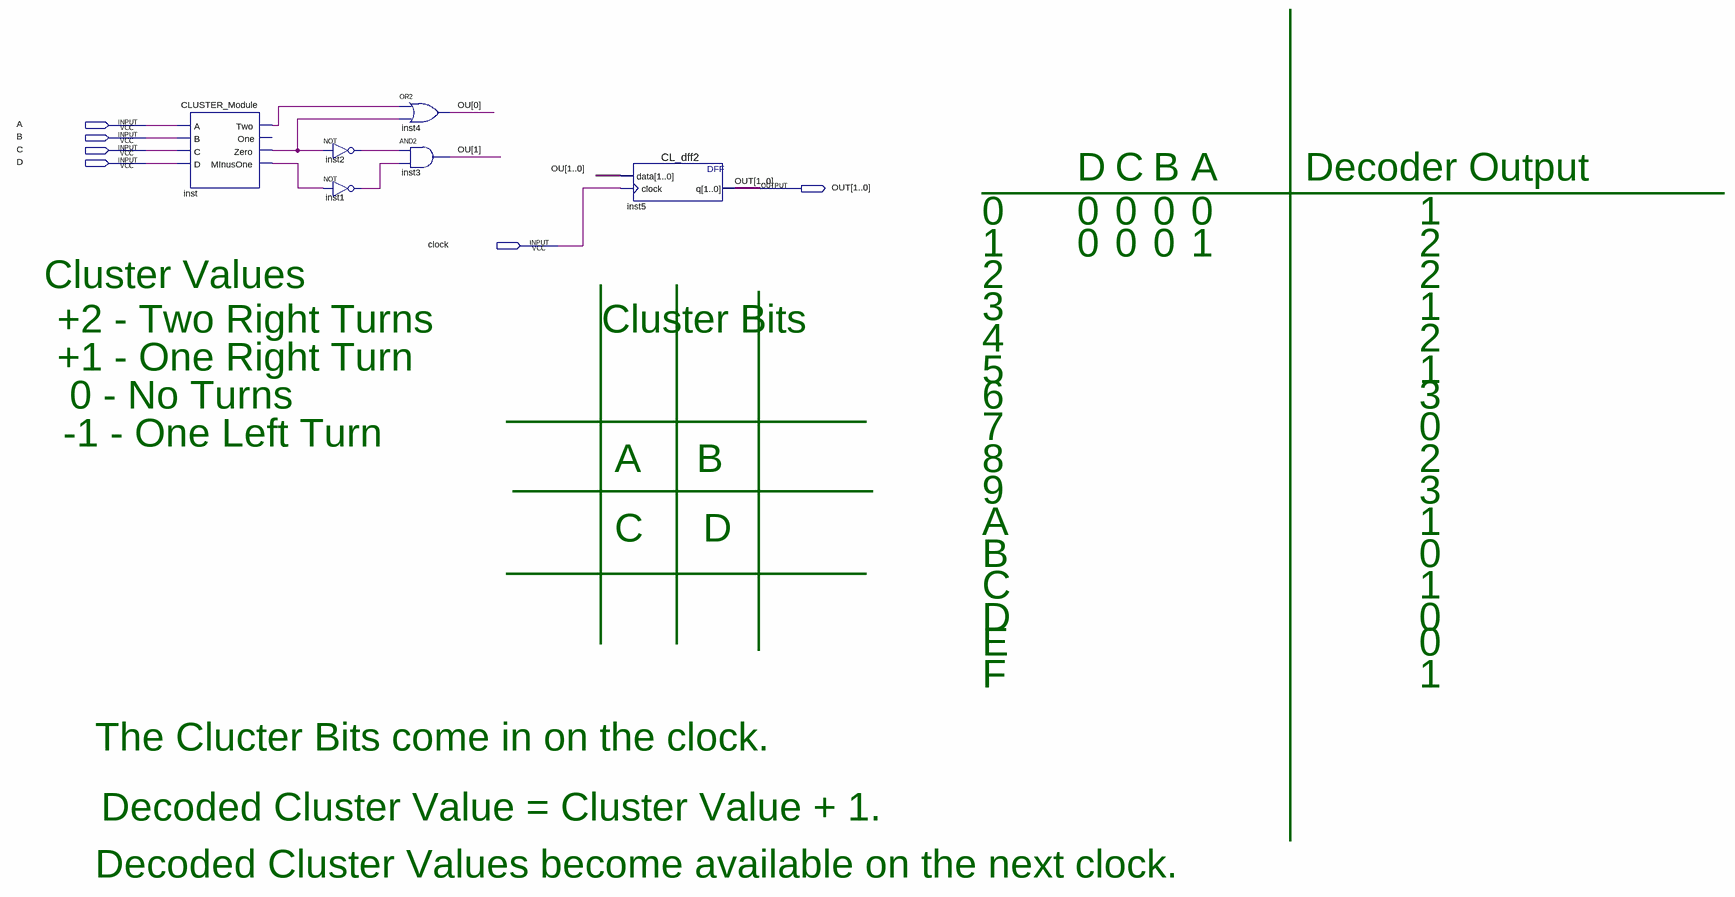
[diagram p0: schematic sheet]
// Quartus schematic CLUSTER_Module_Decoded.bdf as structural Verilog: 6 symbols, 6 pins
module CLUSTER_Module_Decoded (
  input  A,
  input  B,
  input  C,
  input  D,
  input  clock,
  output [1:0] OUT
);

  wire inst1_out, inst2_out, inst_minusone, inst_two, inst_zero;
  wire [1:0] OU;

  CLUSTER_Module inst (
    .A(A), .B(B), .C(C), .D(D), .Two(inst_two), .Zero(inst_zero), .MInusOne(inst_minusone));  // open: One
  not inst2 (inst2_out, inst_zero);
  not inst1 (inst1_out, inst_minusone);
  or inst4 (OU[0], inst_two, inst_zero);
  and inst3 (OU[1], inst2_out, inst1_out);
  CL_dff2 inst5 (.data(OU), .clock(clock), .q(OUT));

  // Notes on the sheet:
  //   _____________________________________
  //   D
  //   C
  //   B
  //   A
  //   Decoder Output
  //   _________________________________
  //   0
  //   0
  //   0
  //   0
  //   0
  //   1
  //   1
  //   0
  //   0
  //   0
  //   1
  //   2
  //   Cluster Values
  //   2
  //   2
  //   3
  //   1
  //   ________________
  //   ________________
  //   ________________
  //   +2 - Two Right Turns
  //   Cluster Bits
  //   4
  //   2
  //   +1 - One Right Turn
  //   5
  //   1
  //   0 - No Turns
  //   6
  //   3
  //   ________________
  //   7
  //   0
  //   -1 - One Left Turn
  //   A
  //   B
  //   8
  //   2
  //   ________________
  //   9
  //   3
  //   A
  //   1
  //   C
  //   D
  //   ________________
  //   B
  //   0
  //   C
  //   1
  //   D
  //   0
  //   E
  //   0
  //   F
  //   1
  //   The Clucter Bits come in on the clock.
  //   Decoded Cluster Value = Cluster Value + 1.
  //   Decoded Cluster Values become available on the next clock.
endmodule
